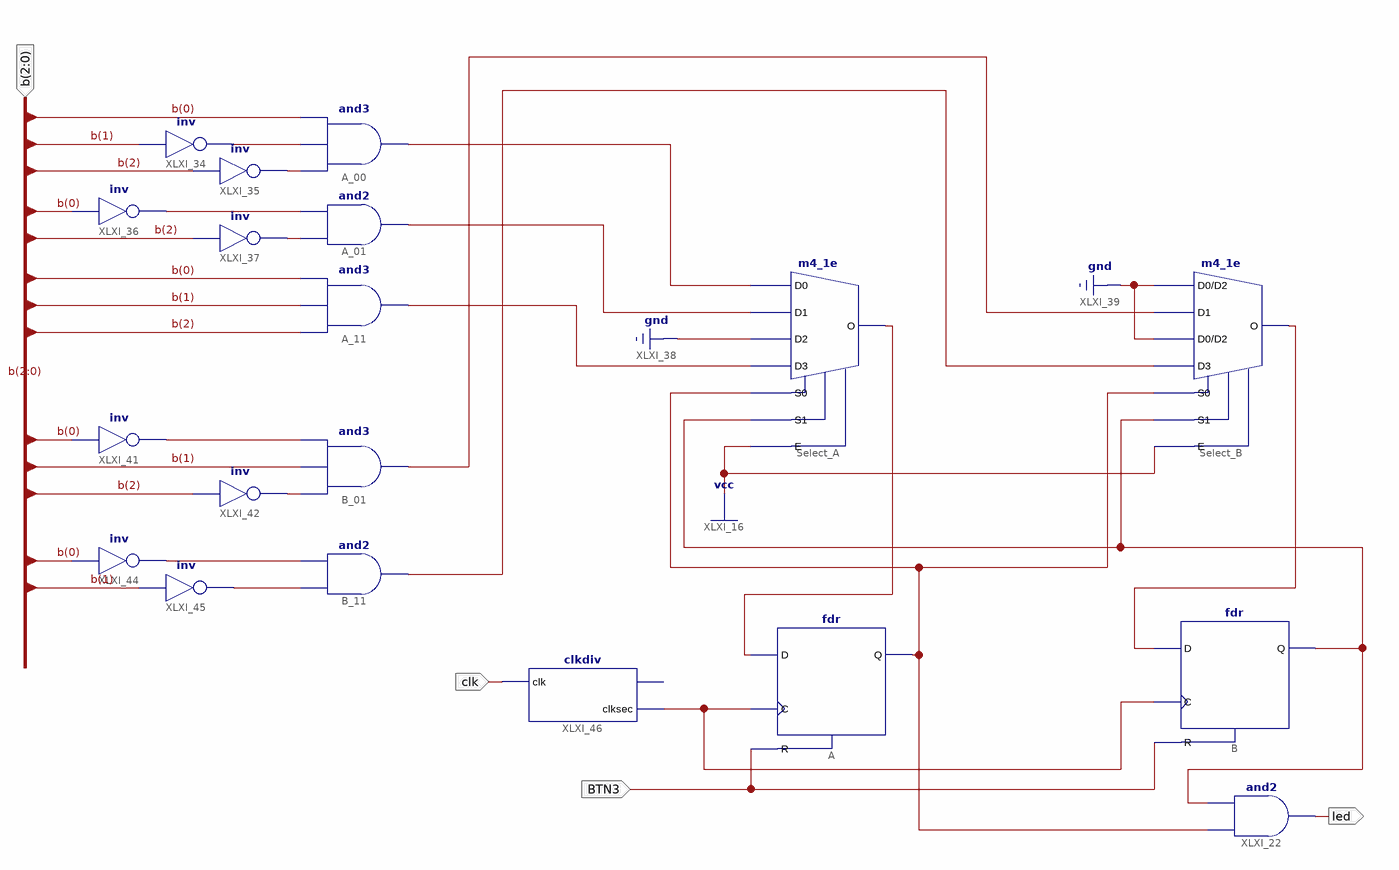
[diagram p0: schematic sheet 1]
// Xilinx ISE schematic toplevel.sch (spartan3e) as structural Verilog: 19 symbols, 4 ports
module toplevel (
  input  [2:0] b,
  input  BTN3,
  input  clk,
  output led
);

  wire XLXN_8, XLXN_11, XLXN_15, XLXN_25, XLXN_45, XLXN_46, XLXN_47, XLXN_48, XLXN_52, XLXN_53, XLXN_54,
       XLXN_60, XLXN_61, XLXN_64, XLXN_65, XLXN_69, XLXN_71, XLXN_73;

  m4_1e Select_B (.D0(1'b0), .D1(XLXN_69), .D2(1'b0), .D3(XLXN_71), .E(1'b1), .S0(XLXN_8), .S1(XLXN_25), .O(XLXN_15));
  m4_1e Select_A (
    .D0(XLXN_54), .D1(XLXN_53), .D2(1'b0), .D3(XLXN_52), .E(1'b1), .S0(XLXN_8), .S1(XLXN_25), .O(XLXN_11));
  fdr A (.C(XLXN_73), .D(XLXN_11), .R(BTN3), .Q(XLXN_8));
  fdr u_B (.C(XLXN_73), .D(XLXN_15), .R(BTN3), .Q(XLXN_25));
  and XLXI_22 (led, XLXN_8, XLXN_25);
  and A_00 (XLXN_54, XLXN_46, XLXN_45, b[0]);
  and A_01 (XLXN_53, XLXN_47, XLXN_48);
  and A_11 (XLXN_52, b[2], b[1], b[0]);
  not XLXI_34 (XLXN_45, b[1]);
  not XLXI_35 (XLXN_46, b[2]);
  not XLXI_36 (XLXN_48, b[0]);
  not XLXI_37 (XLXN_47, b[2]);
  and B_01 (XLXN_69, XLXN_61, b[1], XLXN_60);
  not XLXI_41 (XLXN_60, b[0]);
  not XLXI_42 (XLXN_61, b[2]);
  and B_11 (XLXN_71, XLXN_65, XLXN_64);
  not XLXI_44 (XLXN_64, b[0]);
  not XLXI_45 (XLXN_65, b[1]);
  clkdiv XLXI_46 (.clk(clk), .clksec(XLXN_73));  // open: clk190
endmodule
